# EasyEDA schematic DAAP.json
TITLE: Distributeur Automatique\nd'argent de poche; REV: 1.0; Date: 2019-05-16; Sheet: 1/1; Drawn By: PhaustSceptic; Company: -
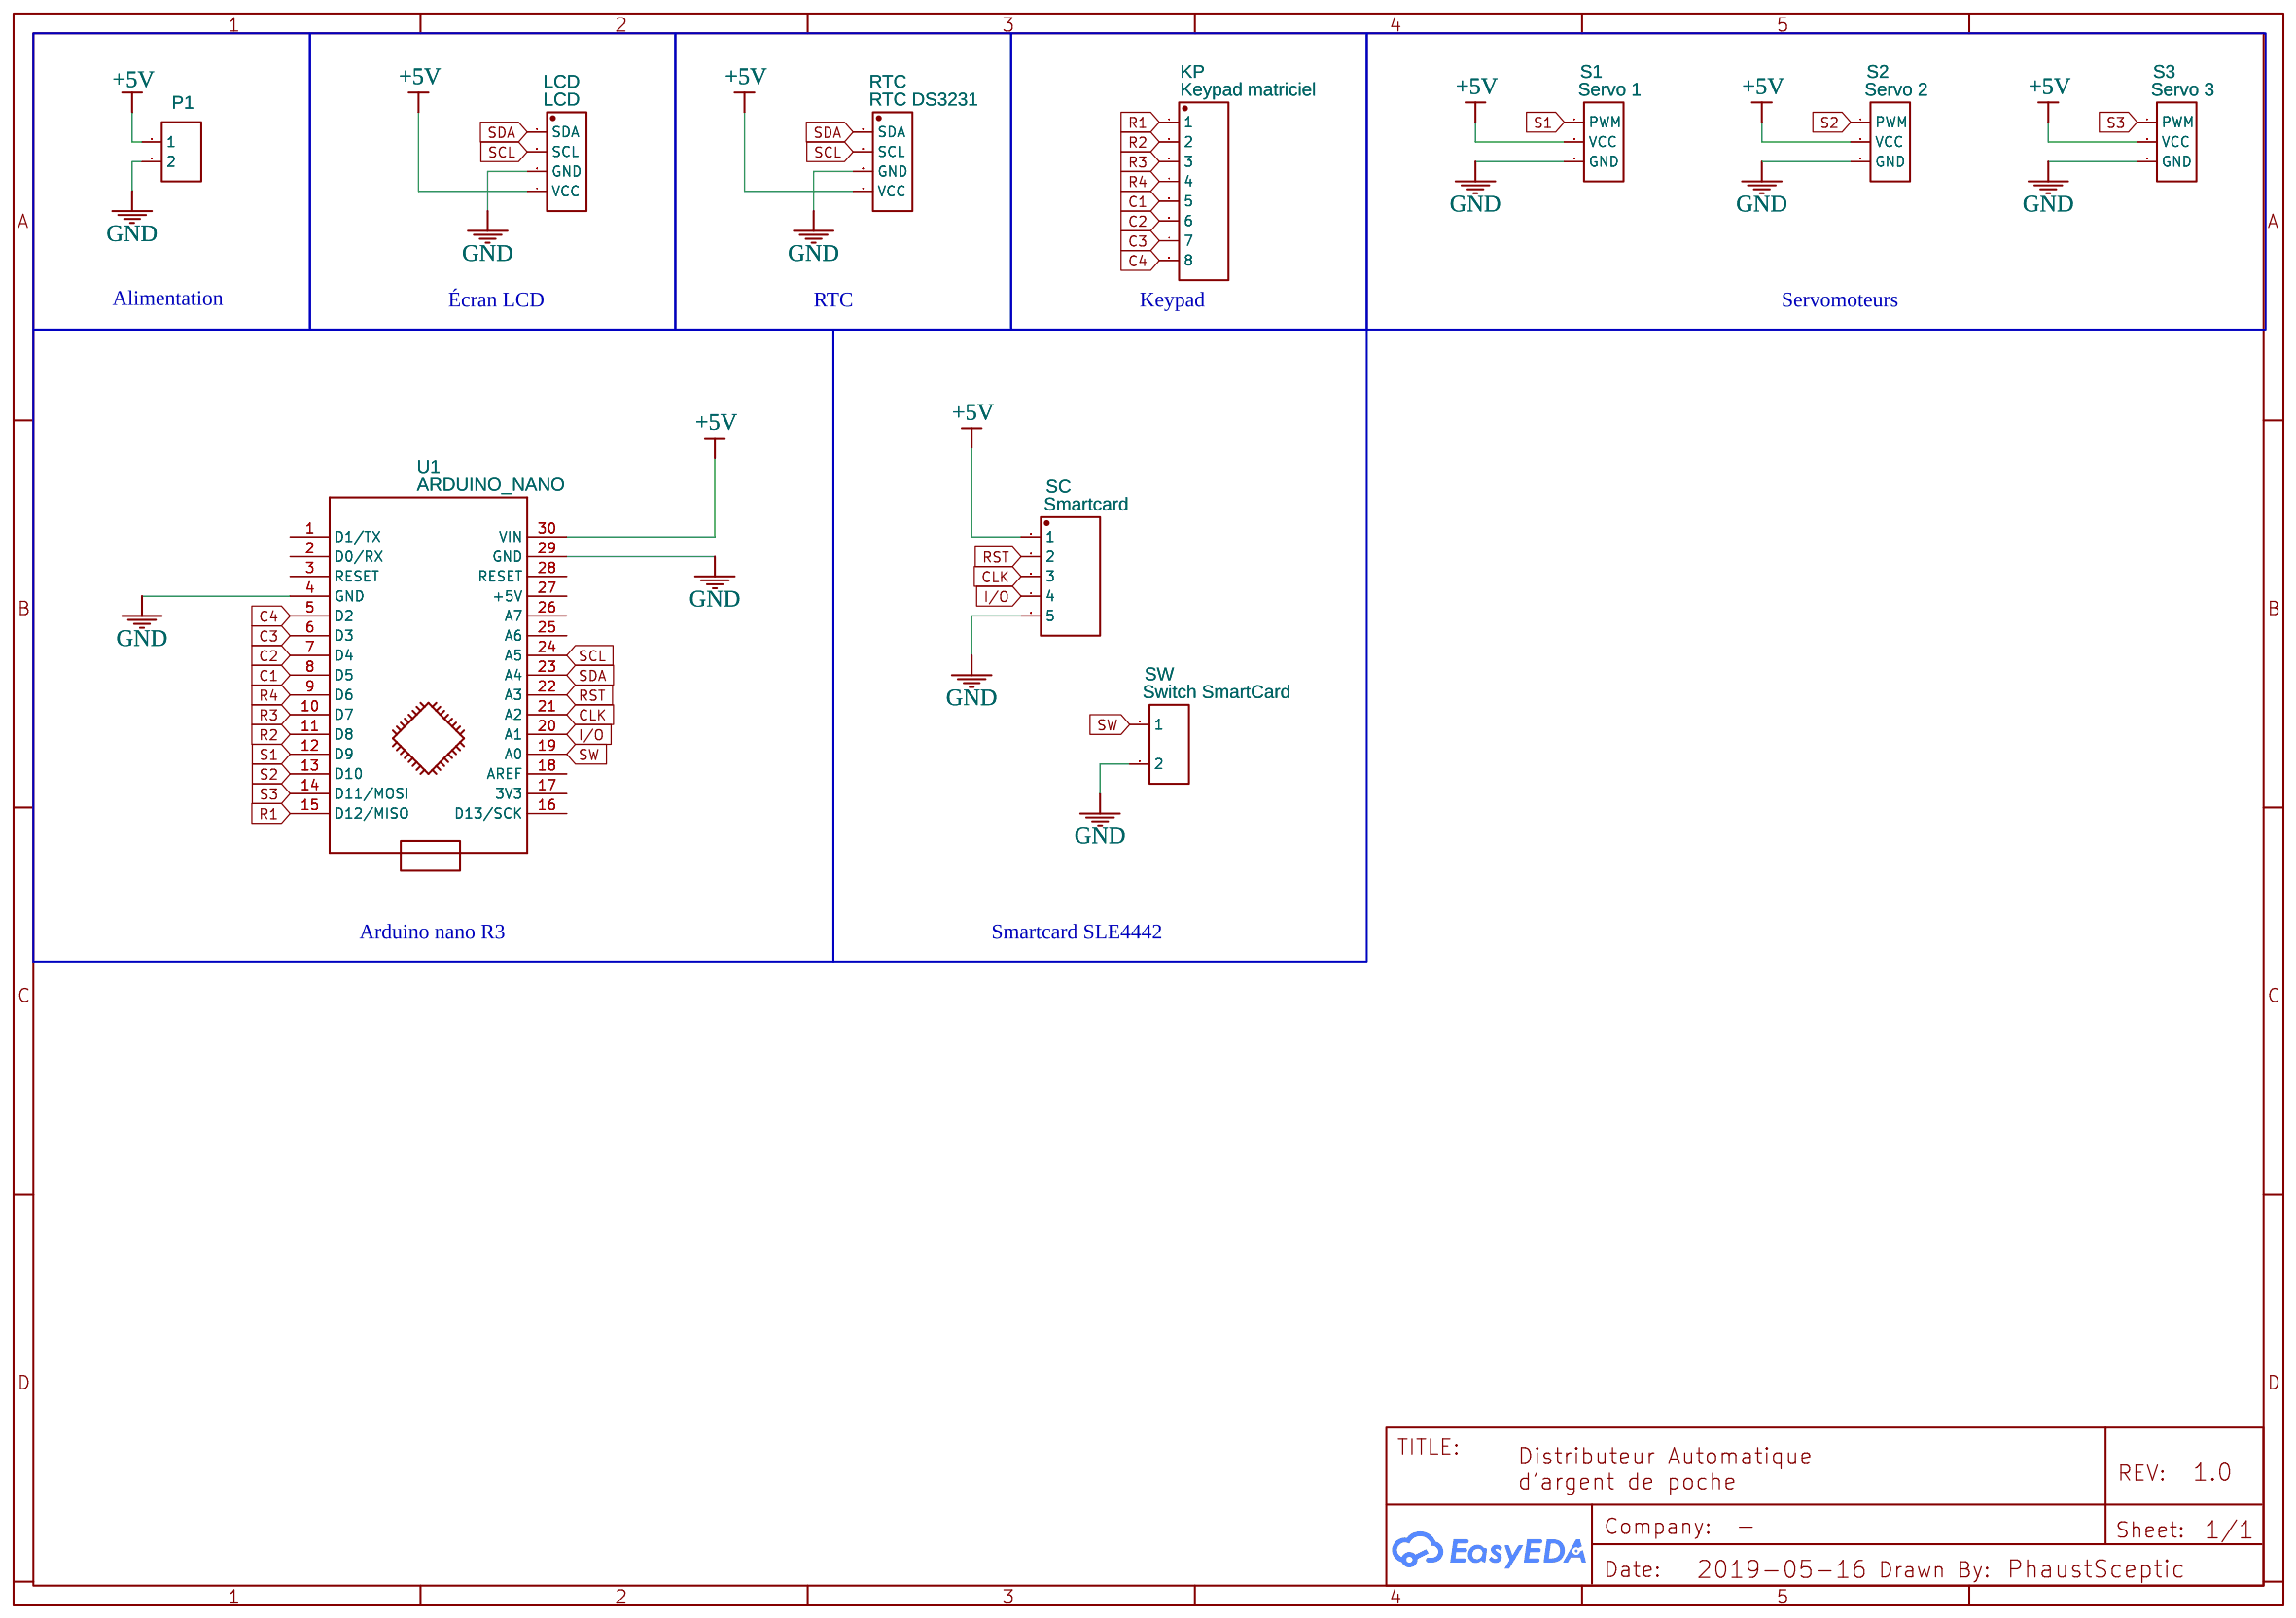
[diagram p0: schematic sheet]

## Parts
KP  Keypad matriciel  [210S-1X8P]
LCD  LCD  [DIP-1X4P-2.54MM-M]
P1  Header-Female-2.54_1x2  [HDR-1X2/2.54]
RTC  RTC DS3231  [DIP-1X4P-2.54MM-M]
S1  Servo 1  [HDR-3X1/2.54]
S2  Servo 2  [HDR-3X1/2.54]
S3  Servo 3  [HDR-3X1/2.54]
SC  Smartcard  [DIP-1X5P-2.54MM-M]
SW  Switch SmartCard  [HDR-2X1/2.54]
U1  ARDUINO_NANO  [ARDUINO_NANO]

## Library data of the parts
KP = -: Supplier: LCSC; Manufacturer: Ckmtw; Manufacturer Part: 210S-1*8P L=11.6MMGold-plated black; Contributor: LCSC; Supplier Part: C124381
LCD RTC = -: Supplier: LCSC; Manufacturer: Ckmtw; Manufacturer Part: 210S-1*4P L=11.6MMGold-plated black; Contributor: LCSC; Supplier Part: C124378
P1 = -: Supplier: LCSC; Manufacturer: BOOMELE; Manufacturer Part: 2.54-1*2PFemale; image: //image.lceda.cn/szlcsc/C49661.jpg; Supplier Part: C49661
S1-S3 = -: Supplier: LCSC; Manufacturer: BOOMELE; Manufacturer Part: Header2.54mm 1*3P; image: //image.lceda.cn/szlcsc/C49257.jpg; Supplier Part: C49257
SC = -: Supplier: LCSC; Manufacturer: Ckmtw; Manufacturer Part: 210S-1*5P L=11.6MMGold-plated black; Contributor: LCSC; Supplier Part: C124379
SW = -: Supplier: LCSC; Manufacturer: TE Connectivity; Manufacturer Part: 826629-2; image: //image.lceda.cn/szlcsc/C86471.jpg; Supplier Part: C86471
U1 = -: sourceId: KGSeAWhDB; Manufacturer Part: ?

## Nets
+5V: LCD.4(VCC) P1.1 RTC.4(VCC) S1.2(VCC) S2.2(VCC) S3.2(VCC) SC.1 U1.30(VIN)
GND: LCD.3(GND) P1.2 RTC.3(GND) S1.3(GND) S2.3(GND) S3.3(GND) SC.5 SW.2 U1.4(GND) U1.29(GND)
C1: KP.5 U1.8(D5)
C2: KP.6 U1.7(D4)
C3: KP.7 U1.6(D3)
C4: KP.8 U1.5(D2)
CLK: SC.3 U1.21(A2)
I/O: SC.4 U1.20(A1)
R1: KP.1 U1.15(D12/MISO)
R2: KP.2 U1.11(D8)
R3: KP.3 U1.10(D7)
R4: KP.4 U1.9(D6)
RST: SC.2 U1.22(A3)
S1: S1.1(PWM) U1.12(D9)
S2: S2.1(PWM) U1.13(D10)
S3: S3.1(PWM) U1.14(D11/MOSI)
SCL: LCD.2(SCL) RTC.2(SCL) U1.24(A5)
SDA: LCD.1(SDA) RTC.1(SDA) U1.23(A4)
SW: SW.1 U1.19(A0)

Not connected (* = marked no-connect by the designer): U1 1(D1/TX) 2(D0/RX) 3(RESET) 16(D13/SCK) 17(3V3) 18(AREF) 25(A6) 26(A7) 27(+5V) 28(RESET)

## Notes on the sheet
- Alimentation
- Écran LCD
- RTC
- Keypad
- Servomoteurs
- Arduino nano R3
- Smartcard SLE4442
